# Altium schematic sheet 06_KEY.SchDoc: KEY
size A4; Date: 20/11/2014; Author: HuangRui <vowstar@gmail.com>; DrawnBy: JiYaping <jyp1817@gmail.com>; Organization: WWW.NODEMCU.COM
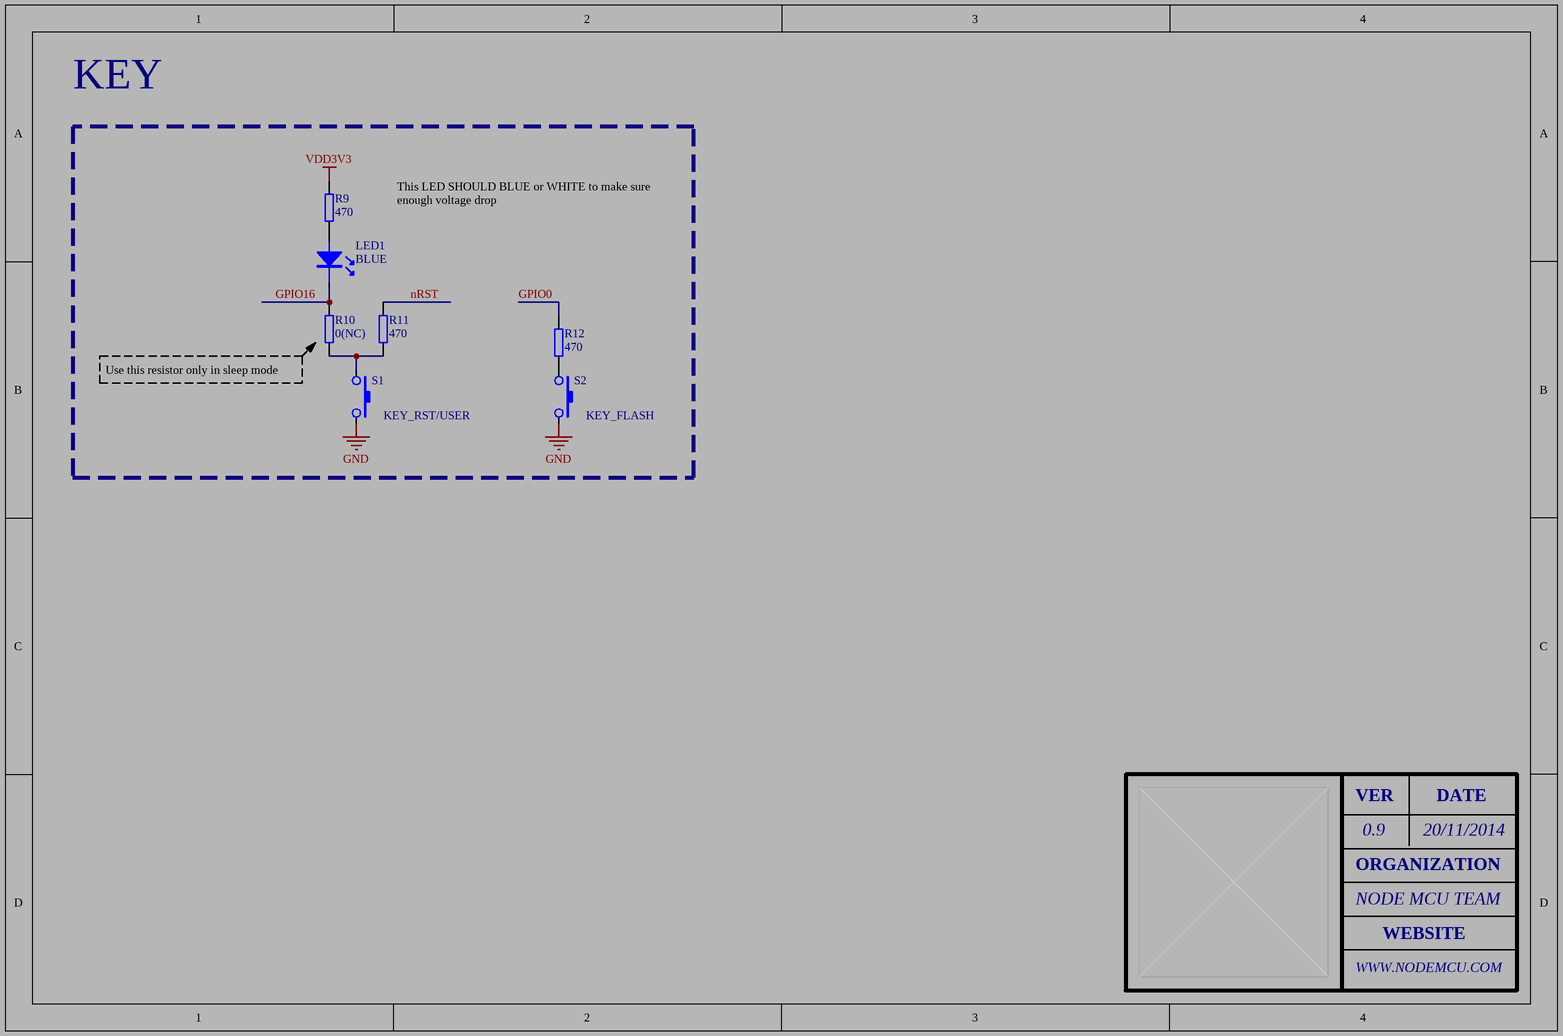
[diagram p0: 06_KEY.SchDoc]

## Parts
LED1  BLUE  [SMT_LED_0603]
R9  470  [SMT_R_0402]
R10  0(NC)  [SMT_R_0402]
R11  470  [SMT_R_0402]
R12  470  [SMT_R_0402]
S1  KEY_RST/USER  [SMT_SW_PTS_820]
S2  KEY_FLASH  [SMT_SW_PTS_820]

## Nets
GND: S1.2 S2.2
VDD3V3: R9.2
GPIO0: R12.2
GPIO16: LED1.2(K) R10.2
nRST: R11.2
NetLED1_1: LED1.1(A) R9.1
NetR10_1: R10.1 R11.1 S1.1
NetR12_1: R12.1 S2.1

## Notes on the sheet
- This LED SHOULD BLUE or WHITE to make sure enough voltage drop
- Use this resistor only in sleep mode
- VER
- 0.9
- DATE
- ORGANIZATION
- NODE MCU TEAM
- WEBSITE

## Library data of the parts
LED1 = SMT_LED_0603: SMT LED
R9-R12 = SMT_R_0402: Surface mount resistor 0402
S1 S2 = SMT_SW_PTS_820: SMT Tactile ‎Switch PTS 820 Series